# Altium project 九键触摸面板-V1.PrjPCB
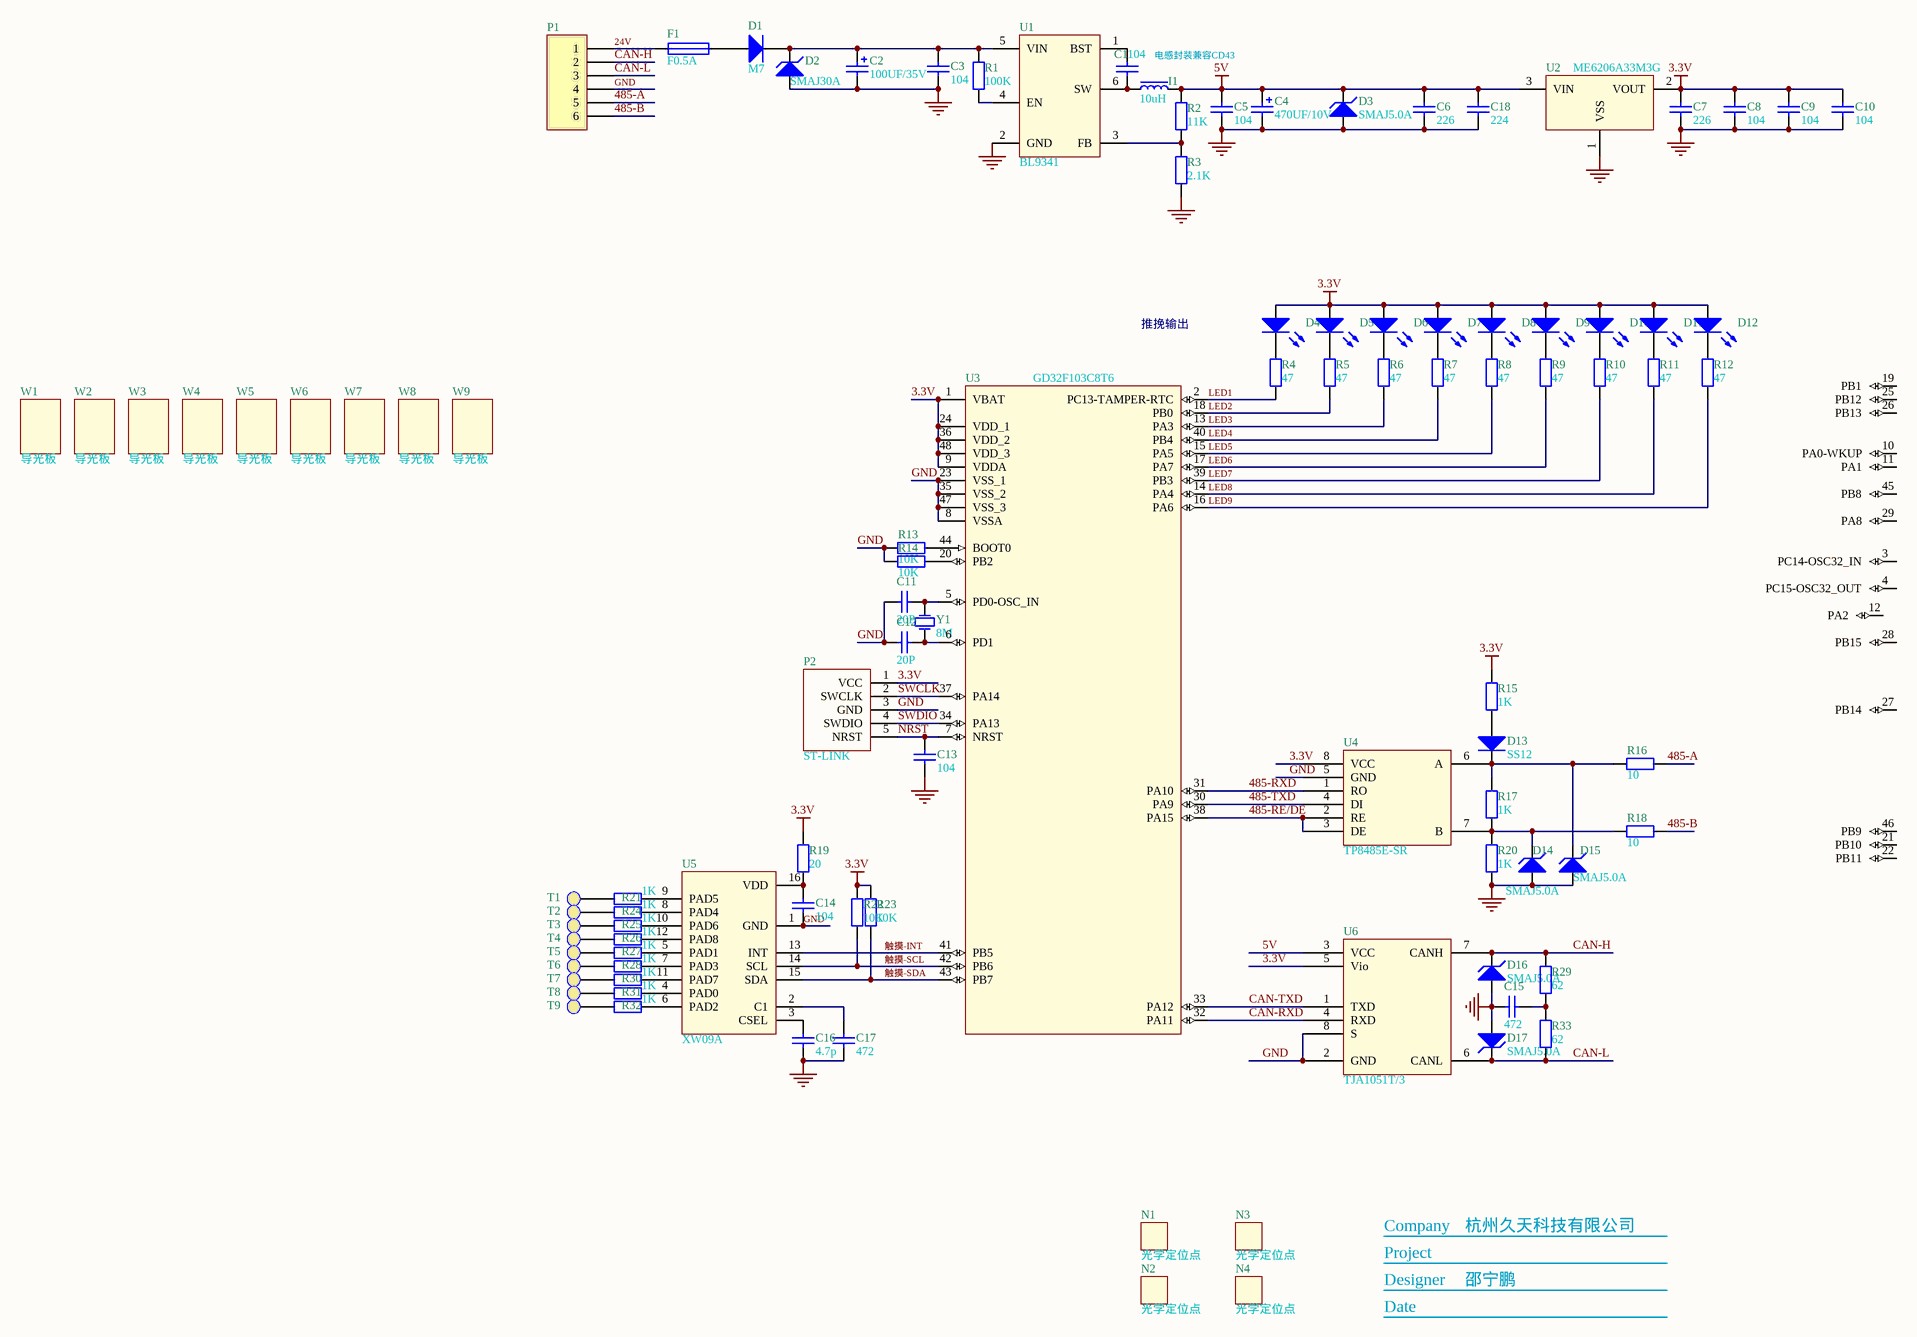
[diagram p0: 九键触摸面板-V1.SchDoc]
1 sheet, 101 parts. Net scope: global (net labels, ports and power ports of the same name join across sheets).
Board file: 九键触摸面板-V1.PcbDoc

## Sheet 九键触摸面板-V1.SchDoc
size A1

### Parts
C1  104  [C-0603]
C2  100UF/35V  [贴片固态电容6.3*7.7]
C3  104  [C-0603]
C4  470UF/10V  [贴片固态电容6.3*7.7]
C5  104  [C-0603]
C6  226  [C-0603]
C7  226  [C-0603]
C8  104  [C-0603]
C9  104  [C-0603]
C10  104  [C-0603]
C11  20P  [C-0603]
C12  20P  [C-0603]
C13  104  [C-0603]
C14  104  [C-0603]
C15  472  [C-0603]
C16  4.7p  [C-0603]
C17  472  [C-0603]
C18  224  [C-0603]
D1  M7  [SMA]
D2  SMAJ30A  [SMA]
D3  SMAJ5.0A  [SMA]
D4  (no value)  [LED-335侧面绿色-M]
D5  (no value)  [LED-335侧面绿色-M]
D6  (no value)  [LED-335侧面绿色-M]
D7  (no value)  [LED-335侧面绿色-M]
D8  (no value)  [LED-335侧面绿色-M]
D9  (no value)  [LED-335侧面绿色-M]
D10  (no value)  [LED-335侧面绿色-M]
D11  (no value)  [LED-335侧面绿色-M]
D12  (no value)  [LED-335侧面绿色-M]
D13  SS12  [SMA]
D14  SMAJ5.0A  [SMA]
D15  SMAJ5.0A  [SMA]
D16  SMAJ5.0A  [SMA]
D17  SMAJ5.0A  [SMA]
F1  F0.5A  [FUSE-1808]
I1  10uH  [4030]
N1  光学定位点  [MARK-1mm-3mm]
N2  光学定位点  [MARK-1mm-3mm]
N3  光学定位点  [MARK-1mm-3mm]
N4  光学定位点  [MARK-1mm-3mm]
P1  (no value)  [KF2EDG5.08V-6P-贴片]
P2  ST-LINK  [5P下载口]
R1  100K  [R-0603]
R2  11K  [R-0603]
R3  2.1K  [R-0603]
R4  47  [R-0603]
R5  47  [R-0603]
R6  47  [R-0603]
R7  47  [R-0603]
R8  47  [R-0603]
R9  47  [R-0603]
R10  47  [R-0603]
R11  47  [R-0603]
R12  47  [R-0603]
R13  10K  [R-0603]
R14  10K  [R-0603]
R15  1K  [R-0603]
R16  10  [R-0603]
R17  1K  [R-1206]
R18  10  [R-0603]
R19  20  [R-0603]
R20  1K  [R-0603]
R21  1K  [R-0603]
R22  10K  [R-0603]
R23  10K  [R-0603]
R24  1K  [R-0603]
R25  1K  [R-0603]
R26  1K  [R-0603]
R27  1K  [R-0603]
R28  1K  [R-0603]
R29  62  [R-1206]
R30  1K  [R-0603]
R31  1K  [R-0603]
R32  1K  [R-0603]
R33  62  [R-1206]
T1  (no value)  [焊点1mm]
T2  (no value)  [焊点1mm]
T3  (no value)  [焊点1mm]
T4  (no value)  [焊点1mm]
T5  (no value)  [焊点1mm]
T6  (no value)  [焊点1mm]
T7  (no value)  [焊点1mm]
T8  (no value)  [焊点1mm]
T9  (no value)  [焊点1mm]
U1  BL9341  [SOT-23-6-m]
U2  ME6206A33M3G  [SOT-23]
U3  GD32F103C8T6  [LQFP48-L]
U4  TP8485E-SR  [SOP-8-m]
U5  XW09A  [SOP-16-M]
U6  TJA1051T/3  [SOP-8-M]
W1  导光板  [导光板20.5*15*2]
W2  导光板  [导光板20.5*15*2]
W3  导光板  [导光板20.5*15*2]
W4  导光板  [导光板20.5*15*2]
W5  导光板  [导光板20.5*15*2]
W6  导光板  [导光板20.5*15*2]
W7  导光板  [导光板20.5*15*2]
W8  导光板  [导光板20.5*15*2]
W9  导光板  [导光板20.5*15*2]
Y1  8M  [HC-49SMD]

### Nets
3.3V: C7.2 C8.2 C9.2 C10.2 D4.1(A) D5.1(A) D6.1(A) D7.1(A) D8.1(A) D9.1(A) D10.1(A) D11.1(A) D12.1(A) P2.1(VCC) R15.1 R19.1 R22.2 R23.2 U2.2(VOUT) U3.1(VBAT) U3.9(VDDA) U3.24(VDD_1) U3.36(VDD_2) U3.48(VDD_3) U4.8(VCC) U6.5(Vio)
5V: C4.1 C5.2 C6.2 C18.2 D3.2(K) I1.2 R2.1 U2.3(VIN) U6.3(VCC)
GND: C2.2 C3.1 C4.2 C5.1 C6.1 C7.1 C8.1 C9.1 C10.1 C11.1 C12.1 C13.1 C14.1 C15.1 C16.1 C17.1 C18.1 D2.1(A) D3.1(A) D14.1(A) D15.1(A) D16.1(A) D17.1(A) P1.4 P2.3(GND) R3.2 R13.2 R14.2 R20.1 U1.2(GND) U2.1(VSS) U3.8(VSSA) U3.23(VSS_1) U3.35(VSS_2) U3.47(VSS_3) U4.5(GND) U5.1(GND) U6.2(GND) U6.8(S)
24V: F1.1 P1.1
485-A: P1.5 R16.1
485-B: P1.6 R18.1
485-RE/DE: U3.38(PA15) U4.2(RE) U4.3(DE)
485-RXD: U3.31(PA10) U4.1(RO)
485-TXD: U3.30(PA9) U4.4(DI)
CAN-H: D16.2(K) P1.2 R29.1 U6.7(CANH)
CAN-L: D17.2(K) P1.3 R33.2 U6.6(CANL)
CAN-RXD: U3.32(PA11) U6.4(RXD)
CAN-TXD: U3.33(PA12) U6.1(TXD)
LED1: R4.2 U3.2(PC13-TAMPER-RTC)
LED2: R5.2 U3.18(PB0)
LED3: R6.2 U3.13(PA3)
LED4: R7.2 U3.40(PB4)
LED5: R8.2 U3.15(PA5)
LED6: R9.2 U3.17(PA7)
LED7: R10.2 U3.39(PB3)
LED8: R11.2 U3.14(PA4)
LED9: R12.2 U3.16(PA6)
NRST: C13.2 P2.5(NRST) U3.7(NRST)
SWCLK: P2.2(SWCLK) U3.37(PA14)
SWDIO: P2.4(SWDIO) U3.34(PA13)
触摸-INT: U3.41(PB5) U5.13(INT)
触摸-SCL: R22.1 U3.42(PB6) U5.14(SCL)
触摸-SDA: R23.1 U3.43(PB7) U5.15(SDA)
NetC1_1: C1.1 I1.1 U1.6(SW)
NetC1_2: C1.2 U1.1(BST)
NetC2_1: C2.1 C3.2 D1.2(K) D2.2(K) R1.1 U1.5(VIN)
NetC11_2: C11.2 U3.5(PD0-OSC_IN) Y1.2(OSC2)
NetC12_2: C12.2 U3.6(PD1) Y1.1(OSC1)
NetC14_2: C14.2 R19.2 U5.16(VDD)
NetC15_2: C15.2 R29.2 R33.1
NetC16_2: C16.2 U5.3(CSEL)
NetC17_2: C17.2 U5.2(C1)
NetD1_1: D1.1(A) F1.2
NetD4_2: D4.2(K) R4.1
NetD5_2: D5.2(K) R5.1
NetD6_2: D6.2(K) R6.1
NetD7_2: D7.2(K) R7.1
NetD8_2: D8.2(K) R8.1
NetD9_2: D9.2(K) R9.1
NetD10_2: D10.2(K) R10.1
NetD11_2: D11.2(K) R11.1
NetD12_2: D12.2(K) R12.1
NetD13_1: D13.1(A) R15.2
NetD13_2: D13.2(K) D15.2(K) R16.2 R17.1 U4.6(A)
NetD14_2: D14.2(K) R17.2 R18.2 R20.2 U4.7(B)
NetR1_2: R1.2 U1.4(EN)
NetR2_2: R2.2 R3.1 U1.3(FB)
NetR13_1: R13.1 U3.44(BOOT0)
NetR14_1: R14.1 U3.20(PB2)
NetR21_1: R21.1 U5.9(PAD5)
NetR21_2: R21.2 T1.1
NetR24_1: R24.1 U5.8(PAD4)
NetR24_2: R24.2 T2.1
NetR25_1: R25.1 U5.10(PAD6)
NetR25_2: R25.2 T3.1
NetR26_1: R26.1 U5.12(PAD8)
NetR26_2: R26.2 T4.1
NetR27_1: R27.1 U5.5(PAD1)
NetR27_2: R27.2 T5.1
NetR28_1: R28.1 U5.7(PAD3)
NetR28_2: R28.2 T6.1
NetR30_1: R30.1 U5.11(PAD7)
NetR30_2: R30.2 T7.1
NetR31_1: R31.1 U5.4(PAD0)
NetR31_2: R31.2 T8.1
NetR32_1: R32.1 U5.6(PAD2)
NetR32_2: R32.2 T9.1

Not connected (* = marked no-connect by the designer): U3 3(PC14-OSC32_IN) 4(PC15-OSC32_OUT) 10(PA0-WKUP) 11(PA1) 12(PA2) 19(PB1) 21(PB10) 22(PB11) 25(PB12) 26(PB13) 27(PB14) 28(PB15) 29(PA8) 45(PB8) 46(PB9)

### Notes on the sheet
- 电感封装兼容CD43
- 推挽输出
- Company
- 杭州久天科技有限公司
- Project
- Designer
- Date
- 邵宁鹏

### Library data of the parts
C1 C3 C5-C10 C18 = Cap: Capacitor; Published: 8-Jun-2000; LatestRevisionDate: 17-Jul-2002; LatestRevisionNote: Re-released for DXP Platform.; PackageReference: RAD-0.3; Publisher: Altium Limited
C2 C4 = Cap Pol1: Polarized Capacitor (Radial); Published: 8-Jun-2000; LatestRevisionDate: 17-Jul-2002; LatestRevisionNote: Re-released for DXP Platform.; PackageReference: RB7.6-15; Publisher: Altium Limited
C11-C17 = Cap-0603: 0805; Published: 8-Jun-2000; LatestRevisionDate: 17-Jul-2002; LatestRevisionNote: Re-released for DXP Platform.; PackageReference: RAD-0.3; Publisher: Altium Limited
D1 = M7: SMA; Published: 8-Jun-2000; LatestRevisionDate: 17-Jul-2002; LatestRevisionNote: Re-released for DXP Platform.; DatasheetVersion: 1989; PackageVersion: 1989; PackageReference: DO-35A; Publisher: Altium Limited; Code_JEDEC: DO-204-AH; ComponentLink1Description: Manufacturer Link; ComponentLink1URL: http://www.national.com/
D2 D3 D14-D17 = TVS-1: SMB
D4-D12 = LED-0603-Blue: Published: 8-Jun-2000; LatestRevisionDate: 08-Jul-2005; LatestRevisionNote: Mech Layer 1 removed.; PackageReference: LED-0; Publisher: Altium Limited
D13 = SS14: SMA
F1 = Fuse 1: Fuse; Published: 8-Jun-2000; LatestRevisionDate: 17-Jul-2002; LatestRevisionNote: Re-released for DXP Platform.; PackageReference: PIN-W2/E2.8; Publisher: Altium Limited
I1 = Inductance3
N1-N4 = 无引脚
P1 = Header 6: Header, 6-Pin; LatestRevisionDate: 17-Jul-2002; LatestRevisionNote: Re-released for DXP Platform.; Publisher: Altium Limited
P2 = ST-LINK-STM32
R1-R14 R19 R21-R28 R30-R32 = Res2-0603: 0603; Published: 8-Jun-2000; LatestRevisionDate: 17-Jul-2002; LatestRevisionNote: Re-released for DXP Platform.; PackageReference: AXIAL-0.4; Publisher: Altium Limited
R15 R17 R20 = Res2: Resistor; Published: 8-Jun-2000; LatestRevisionDate: 17-Jul-2002; LatestRevisionNote: Re-released for DXP Platform.; PackageReference: AXIAL-0.4; Publisher: Altium Limited
  R17: Value: 1K
R16 R18 R29 R33 = Res2: Resistor; Value: 1K; Published: 8-Jun-2000; LatestRevisionDate: 17-Jul-2002; LatestRevisionNote: Re-released for DXP Platform.; PackageReference: AXIAL-0.4; Publisher: Altium Limited
T1-T9 = 测试点
U2 = ME6206A33M3G: LDO稳压 SOT-23
U4 = MAX3082: RS485总线转串口
Y1 = 晶振